# EAGLE schematic roboproj-2 (EAGLE 9.6.2)

## Sheet 1 of 4
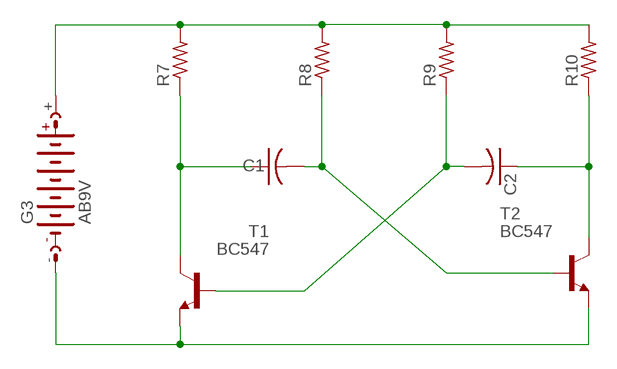
[diagram p0: schematic, sheet 1]

### Parts
C1  C-USC0805  [C0805]
C2  C-USC0805  [C0805]
G3  AB9V  [AB9V]
R7  R-US_R0805  [R0805]
R8  R-US_R0805  [R0805]
R9  R-US_R0805  [R0805]
R10  R-US_R0805  [R0805]
T1  BC547  [TO92]
T2  BC547  [TO92]

### Nets
N$7: C1.1 R7.1 T1.3(C)
N$8: G3.- T1.1(E) T2.1(E)
N$9: C2.1 R10.1 T2.3(C)
N$10: C2.2 R9.1 T1.2(B)
N$11: C1.2 R8.1 T2.2(B)
N$12: G3.+ R7.2 R8.2 R9.2 R10.2

## Sheet 2 of 4
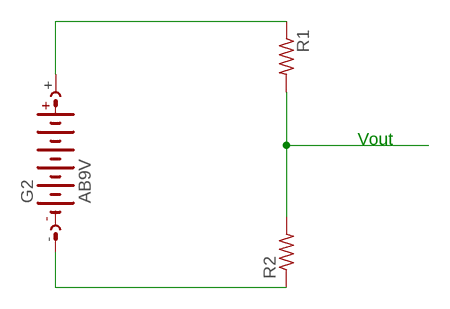
[diagram p1: schematic, sheet 2]

### Parts
G2  AB9V  [AB9V]
R1  R-US_R0805  [R0805]
R2  R-US_R0805  [R0805]

### Nets
N$1: G2.+ R1.1
N$2: R1.2 R2.2
N$3: G2.- R2.1

### Notes on the sheet
- Vout

## Sheet 3 of 4
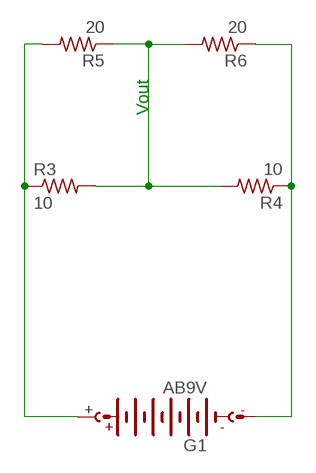
[diagram p2: schematic, sheet 3]

### Parts
G1  AB9V  [AB9V]
R3  10  R-US_R0805  [R0805]
R4  10  R-US_R0805  [R0805]
R5  20  R-US_R0805  [R0805]
R6  20  R-US_R0805  [R0805]

### Nets
N$4: G1.+ R3.1 R5.2
N$5: R3.2 R4.2 R5.1 R6.2
N$6: G1.- R4.1 R6.1

### Notes on the sheet
- Vout

## Sheet 4 of 4
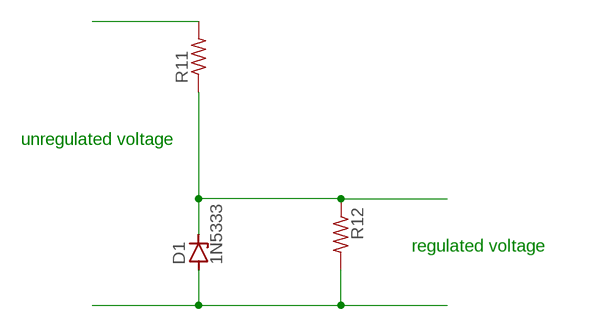
[diagram p3: schematic, sheet 4]

### Parts
D1  1N5333  [C1702-15]
R11  R-US_R0805  [R0805]
R12  R-US_R0805  [R0805]

### Nets
N$13: D1.C R11.1 R12.1
N$14: D1.A R12.2
N$15: R11.2

### Notes on the sheet
- unregulated voltage
- regulated voltage

## Library data of the parts
C1 C2 = rcl:C-US: CAPACITOR, American symbol; SPICEPREFIX: C
D1 = diode:1N5333: Z DIODE 3.3 V, 5W, 5 percent (Motorola)
G1-G3 = battery:AB9V: 9-V BATTERY CLIP
R1-R12 = rcl:R-US_: RESISTOR, American symbol; SPICEPREFIX: R
T1 T2 = transistor:BC547: NPN TRANSISTOR